# EAGLE design presentation (EAGLE 9.6.2)
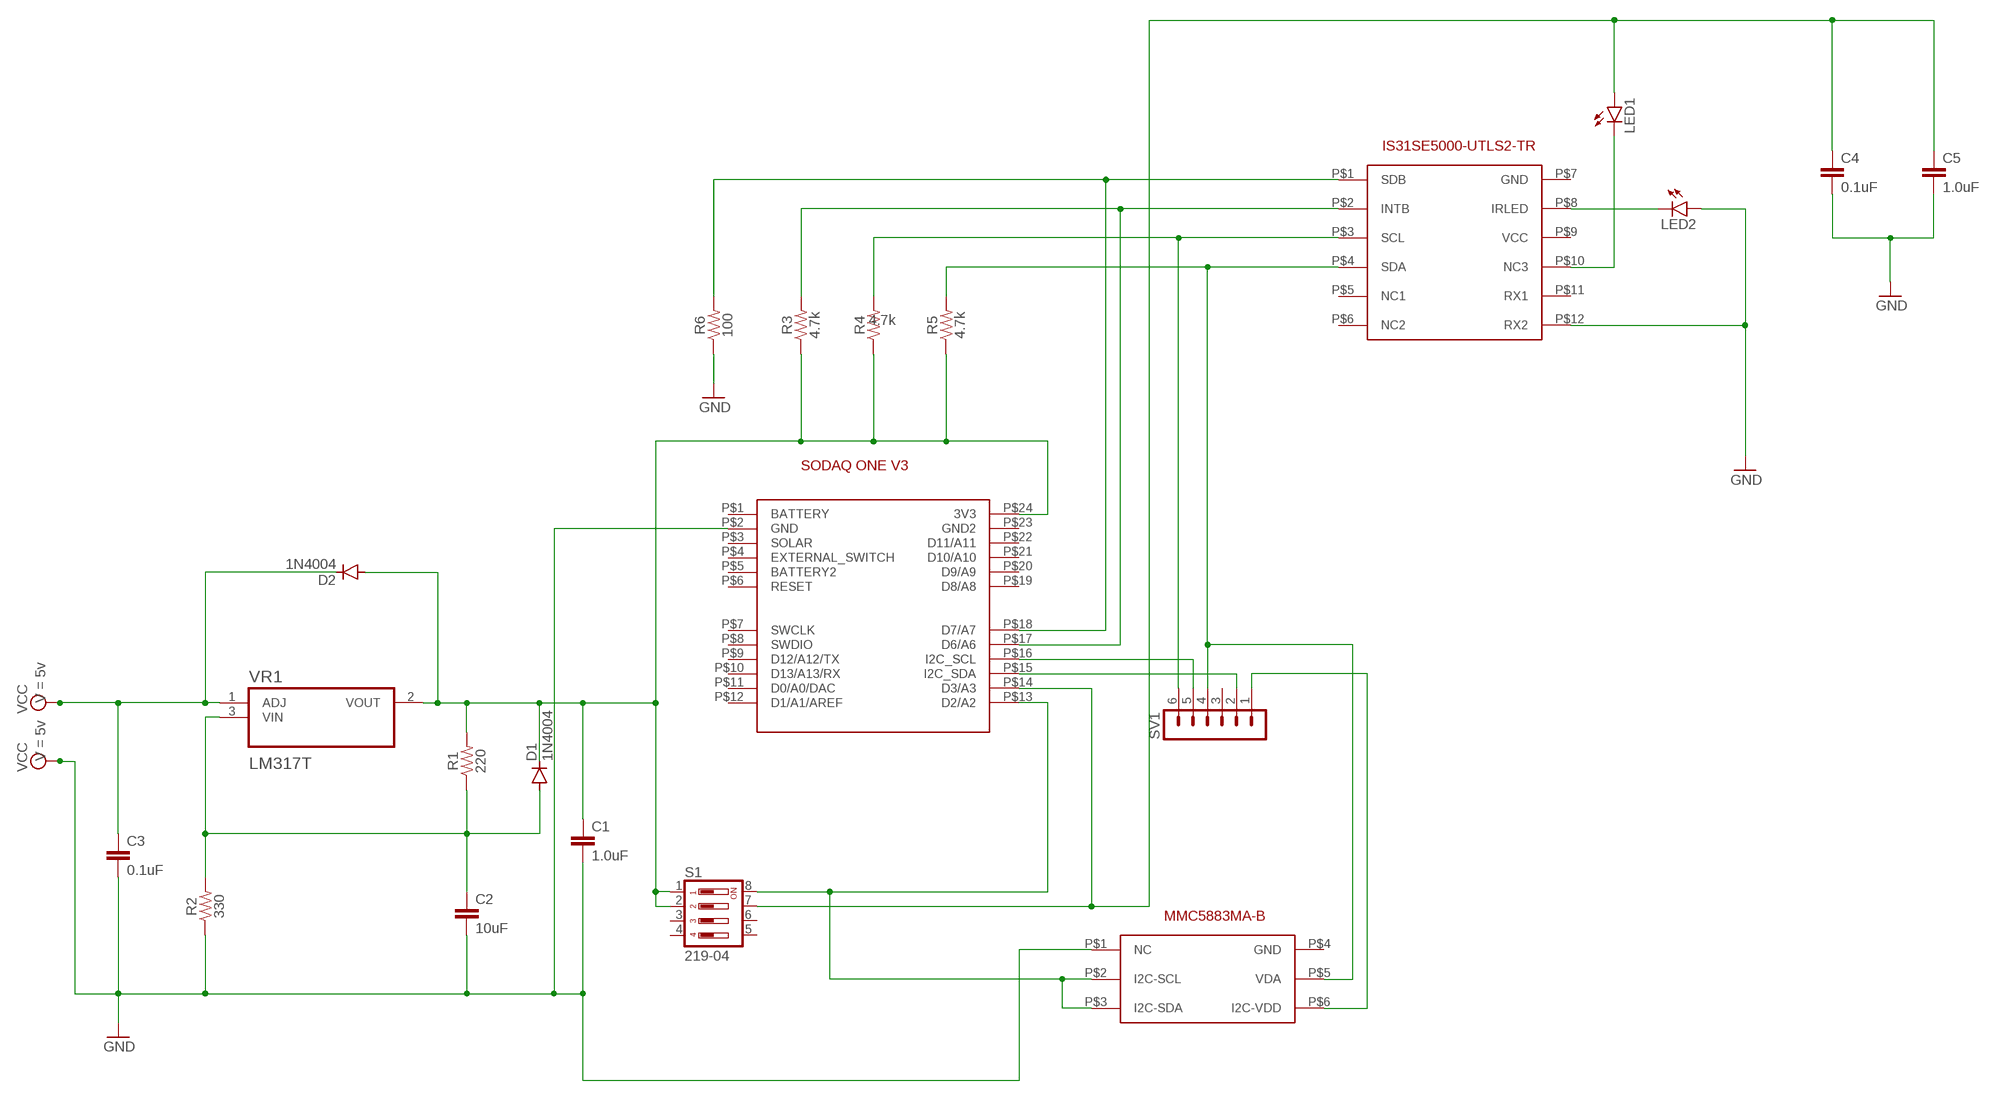
[diagram p0: schematic, sheet 1]

## Parts
C1  1.0uF  1.0UF-0402-16V-10%  [0402]
C2  10uF  10UF-0603-6.3V-20%  [0603]
C3  0.1uF  0.1UF-0402-6.3V-10%-X7R  [0402]
C4  0.1uF  0.1UF-0402-6.3V-10%-X7R  [0402]
C5  1.0uF  1.0UF-0402-16V-10%  [0402]
D1  1N4004  [DO41-10]
D2  1N4004  [DO41-10]
LED1  LED5MM  [LED5MM]
LED2  LED5MM  [LED5MM]
R1  220  220OHM-0603-1/10W-1%  [0603]
R2  330  330OHM-0603-1/10W-1%  [0603]
R3  4.7k  4.7KOHM-0603-1/10W-1%  [0603]
R4  4.7k  4.7KOHM-0603-1/10W-1%  [0603]
R5  4.7k  4.7KOHM-0603-1/10W-1%  [0603]
R6  100  100OHM-0603-1/10W-1%  [0603]
S1  219-04  [CTS-219-04]
SV1  MA06-1  [MA06-1]
U$1  SODAQONE  [SODAQONE]
U$2  MMC5883MA-B  [MMC5883MA-B]
U$3  IS31SE5000  [IS31SE5000]
VR1  LM317T  [TO254P1054X470X1955-3]

## Nets
GND: C4.2 C5.2 LED2.A R6.1 U$3.P$12(RX2)
N$1: C1.1 D1.C D2.A R1.2 R3.1 R4.1 R5.1 S1.1 S1.2 U$1.P$24(3V3) VR1.2(VOUT)
N$2: SV1.1 U$2.P$6(I2C-VDD)
N$3: R5.2 SV1.4 U$2.P$5(VDA) U$3.P$4(SDA)
N$4: S1.8 U$1.P$13(D2/A2) U$2.P$2(I2C-SCL) U$2.P$3(I2C-SDA)
N$5: C4.1 C5.1 LED1.A S1.7 U$1.P$14(D3/A3)
N$6: C2.1 D1.A R1.1 R2.2 VR1.3(VIN)
N$7: R6.2 U$1.P$18(D7/A7) U$3.P$1(SDB)
N$8: R3.2 U$1.P$17(D6/A6) U$3.P$2(INTB)
N$9: R4.2 SV1.6 U$3.P$3(SCL)
N$11: LED2.K(C) U$3.P$8(IRLED)
N$12: LED1.K(C) U$3.P$10(NC3)
N$13: SV1.2 U$1.P$15(I2C_SDA)
N$14: SV1.5 U$1.P$16(I2C_SCL)
VCC: C1.2 C2.2 C3.1 C3.2 D2.C R2.1 U$1.P$2(GND) U$2.P$1(NC) VR1.1(ADJ) ; supply symbol labelled GND
Unconnected: S1.3 S1.4 S1.5 S1.6 SV1.3 U$1.P$1(BATTERY) U$1.P$3(SOLAR) U$1.P$4(EXTERNAL_SWITCH) U$1.P$5(BATTERY2) U$1.P$6(RESET) U$1.P$7(SWCLK) U$1.P$8(SWDIO) U$1.P$9(D12/A12/TX) U$1.P$10(D13/A13/RX) U$1.P$11(D0/A0/DAC) U$1.P$12(D1/A1/AREF) U$1.P$19(D8/A8) U$1.P$20(D9/A9) U$1.P$21(D10/A10) U$1.P$22(D11/A11) U$1.P$23(GND2) U$2.P$4(GND) U$3.P$5(NC1) U$3.P$6(NC2) U$3.P$7(GND) U$3.P$9(VCC) U$3.P$11(RX1)

## Library data of the parts
C1 C5 = SparkFun-Capacitors:1.0UF: 1µF ceramic capacitors A capacitor is a passive two-terminal electrical component used to store electrical energy temporarily in an electric field.; PROD_ID: CAP-12417
C2 = SparkFun-Capacitors:10UF: 10.0µF ceramic capacitors A capacitor is a passive two-terminal electrical component used to store electrical energy temporarily in an electric field.; PROD_ID: CAP-11015
C3 C4 = SparkFun-Capacitors:0.1UF: 0.1µF ceramic capacitors A capacitor is a passive two-terminal electrical component used to store electrical energy temporarily in an electric field.; PROD_ID: CAP-14993
D1 D2 = diode:1N4004: DIODE general purpose rectifier, 1 A
LED1 LED2 = led:LED: LED OSRAM: - CHIPLED LG R971, LG N971, LY N971, LG Q971, LY Q971, LO R971, LY R971 LH N974, LH R974 LS Q976, LO Q976, LY Q976 LO Q996 - Hyper CHIPLED LW Q18S LB Q993, LB Q99A, LB R99A - SideLED LS A670, LO A670, LY A670, LG A670, LP A670 LB A673, LV A673, LT A673, LW A673 LH A674 LY A675 LS A676, LA A676, LO A676, LY A676, LW A676 LS A679, LY A679, LG A679 - Hyper Micro SIDELED® LS Y876, LA Y876, LO Y876, LY Y876 LT Y87S - SmartLED LW L88C, LW L88S LB L89C, LB L89S, LG L890 LS L89K, LO L89K, LY L89K LS L896, LA L896, LO L896, LY L896 - TOPLED LS T670, LO T670, LY T670, LG T670, LP T670 LSG T670, LSP T670, LSY T670, LOP T670, LYG T670 LG T671, LOG T671, LSG T671 LB T673, LV T673, LT T673, LW T673 LH T674 LS T676, LA T676, LO T676, LY T676, LB T676, LH T676, LSB T676, LW T676 LB T67C, LV T67C, LT T67C, LS T67K, LO T67K, LY T67K, LW E67C LS E67B, LA E67B, LO E67B, LY E67B, LB E67C, LV E67C, LT E67C LW T67C LS T679, LY T679, LG T679 LS T770, LO T770, LY T770, LG T770, LP T770 LB T773, LV T773, LT T773, LW T773 LH T774 LS E675, LA E675, LY E675, LS T675 LS T776, LA T776, LO T776, LY T776, LB T776 LHGB T686 LT T68C, LB T68C - Hyper Mini TOPLED® LB M676 - Mini TOPLED Santana® LG M470 LS M47K, LO M47K, LY M47K Source: http://www.osram.convergy.de LUXEON: - LUMILED® LXK2-PW12-R00, LXK2-PW12-S00, LXK2-PW14-U00, LXK2-PW14-V00 LXK2-PM12-R00, LXK2-PM12-S00, LXK2-PM14-U00 LXK2-PE12-Q00, LXK2-PE12-R00, LXK2-PE12-S00, LXK2-PE14-T00, LXK2-PE14-U00 LXK2-PB12-K00, LXK2-PB12-L00, LXK2-PB12-M00, LXK2-PB14-N00, LXK2-PB14-P00, LXK2-PB14-Q00 LXK2-PR12-L00, LXK2-PR12-M00, LXK2-PR14-Q00, LXK2-PR14-R00 LXK2-PD12-Q00, LXK2-PD12-R00, LXK2-PD12-S00 LXK2-PH12-R00, LXK2-PH12-S00 LXK2-PL12-P00, LXK2-PL12-Q00, LXK2-PL12-R00 Source: www.luxeon.com KINGBRIGHT: KA-3528ASYC Source: www.kingbright.com
R1 = SparkFun-Resistors:220OHM: 220Ω resistor A resistor is a passive two-terminal electrical component that implements electrical resistance as a circuit element. Resistors act to reduce current flow, and, at the same time, act to lower voltage levels within circuits. - Wikipedia; PROD_ID: RES-07861
R2 = SparkFun-Resistors:330OHM: 330Ω resistor A resistor is a passive two-terminal electrical component that implements electrical resistance as a circuit element. Resistors act to reduce current flow, and, at the same time, act to lower voltage levels within circuits. - Wikipedia; PROD_ID: RES-00818
R3-R5 = SparkFun-Resistors:4.7KOHM: 4.7kΩ resistor A resistor is a passive two-terminal electrical component that implements electrical resistance as a circuit element. Resistors act to reduce current flow, and, at the same time, act to lower voltage levels within circuits. - Wikipedia; PROD_ID: RES-07857
R6 = SparkFun-Resistors:100OHM: 100Ω resistor A resistor is a passive two-terminal electrical component that implements electrical resistance as a circuit element. Resistors act to reduce current flow, and, at the same time, act to lower voltage levels within circuits. - Wikipedia; PROD_ID: RES-07863
S1 = switch-dil:219-04*: Surface Mount DIP Switch Series 219 SMT CTS Electronic Components Sourc: www.ctscorp.com; OC_FARNELL: unknown; OC_NEWARK: unknown
SV1 = con-lstb:MA06-1: PIN HEADER; OC_FARNELL: unknown; OC_NEWARK: unknown
U$1 = SODAQONE:SODAQONE: Designed by Prem and Pranav
U$2 = MMC5883MA-B:MMC5883MA-B: Designed by Prem and Pranav
U$3 = IS31SE5000:IS31SE5000
VR1 = LM317T:LM317T: Check prices <https://pricing.snapeda.com/parts/LM317T/Texas%20Instruments/view-part?ref=eda>; AVAILABILITY: Good; DESCRIPTION: 1.5-A, 40-V, adjustable linear voltage regulator 3-TO-220; MF: Texas Instruments; MP: LM317T; PACKAGE: TO-220-3 Texas Instruments; PRICE: None; PURCHASE-URL: https://pricing.snapeda.com/search/part/LM317T/?ref=eda

## Board
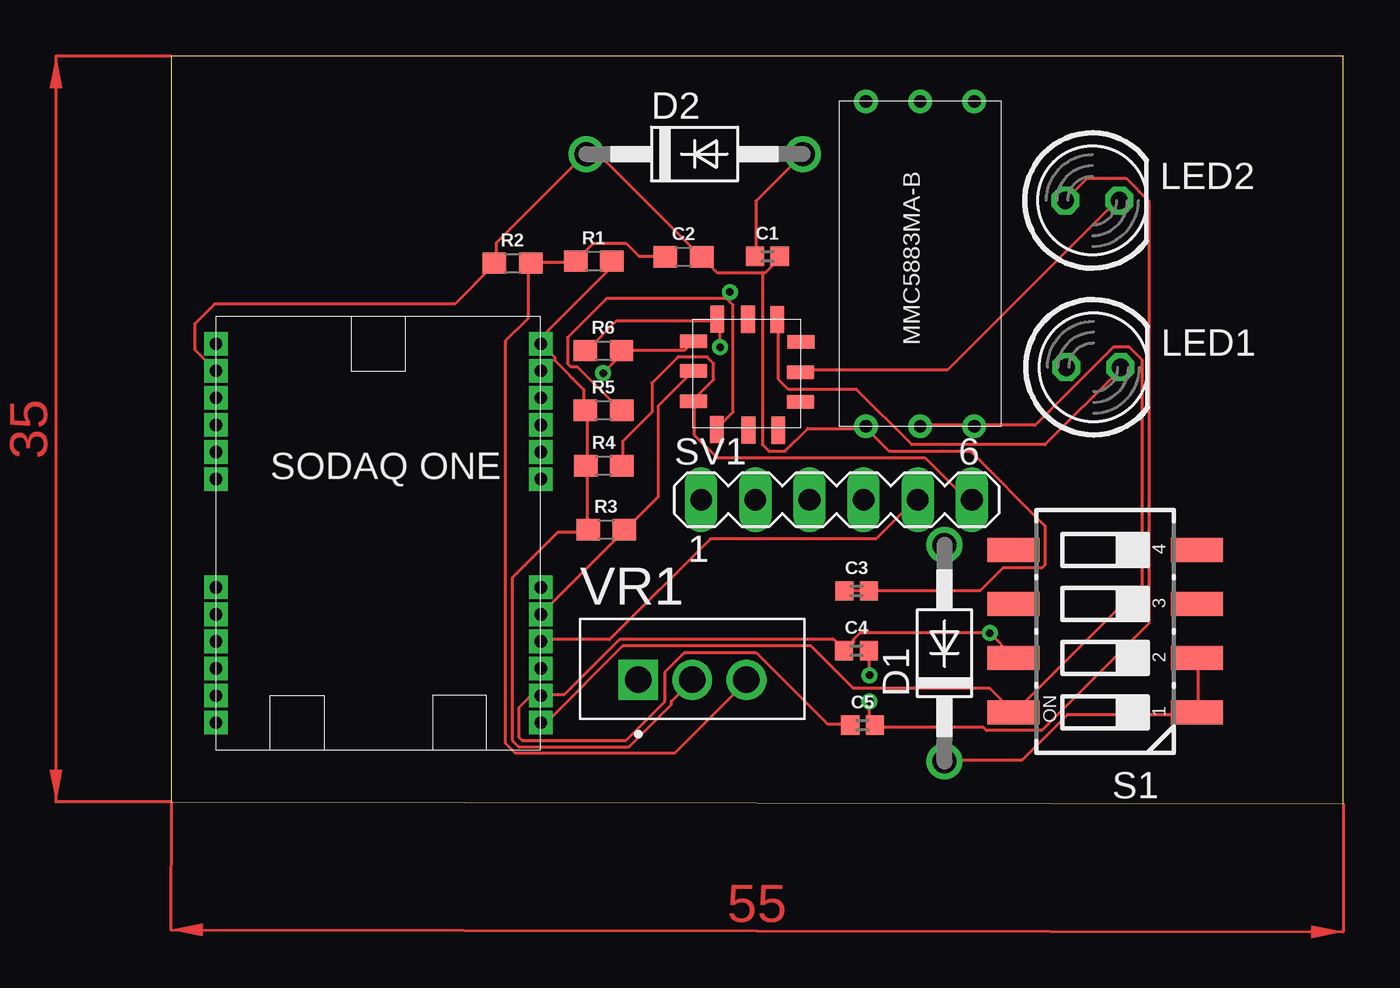
[diagram p1: board, top side]
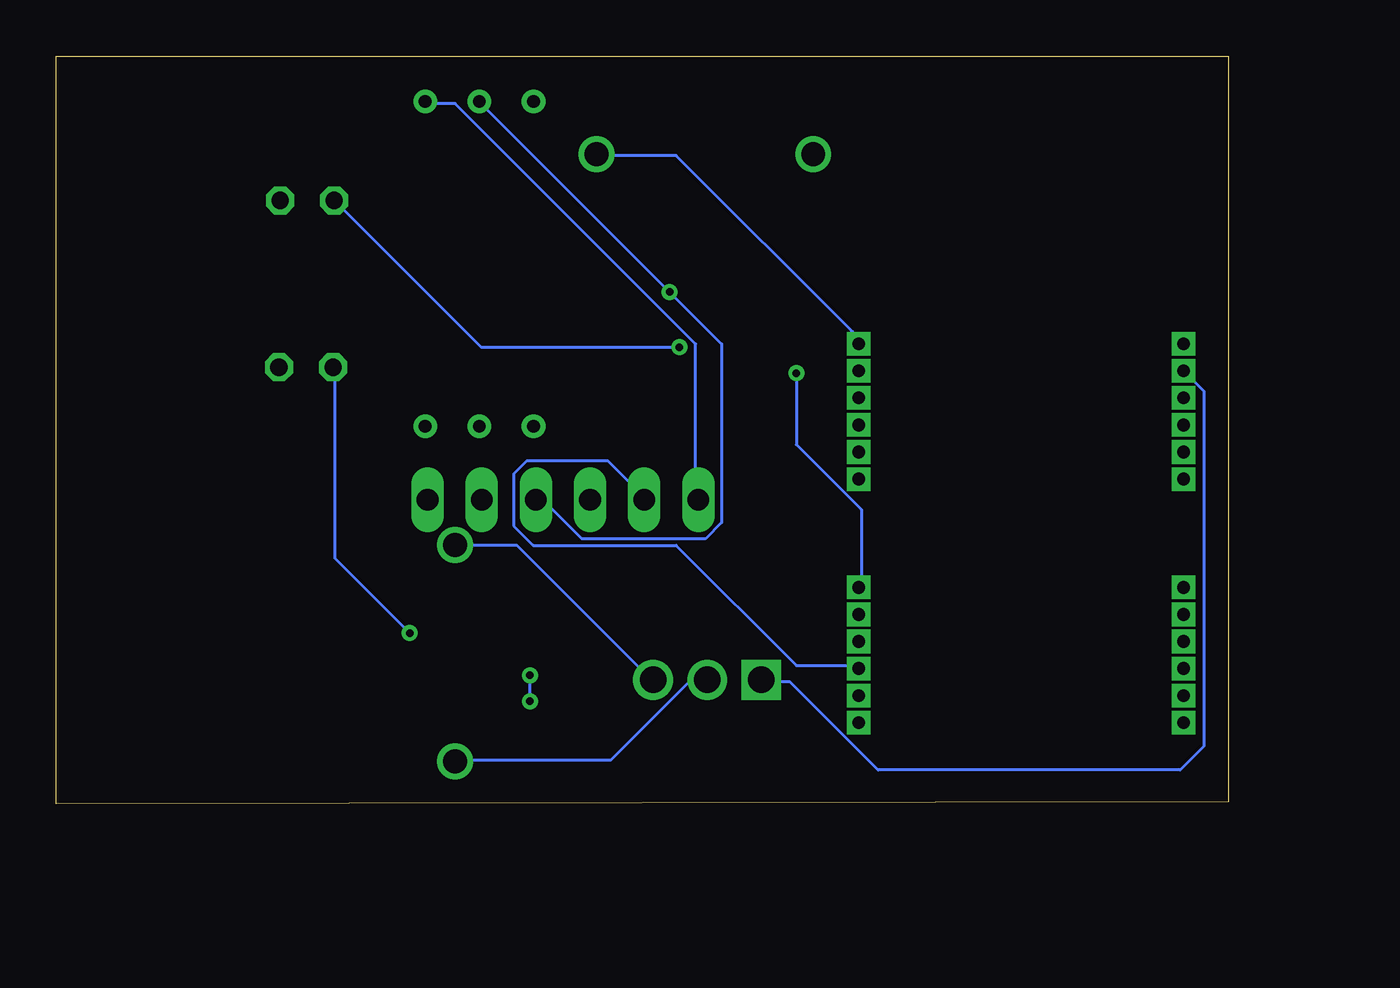
[diagram p2: board, bottom side, seen from below]

Size 55 x 35.1 mm. Coordinates in mm from the lower left corner, seen from the top.
Outline: 0,0.1 55,0 55,35.1 0,35.1 0,0.1
Copper layers (1*16): Top 0.035mm / dielectric 1.5mm / Bottom 0.035mm
Design rules "default": minimum track width 6mil, minimum drill 0.35mm, track to track 6mil, track to pad 6mil, pad to pad 6mil, via to via 6mil, smd to smd 6mil, copper to edge 40mil, drill to drill 6mil, minimum pad ring 10mil, minimum via ring 8mil, stop-mask expansion 4mil, vias tented up to drill 0mil, thermal gap 10mil

### Footprints (pad centres in the part's own frame; a part is rotated, then mirrored left to right if it is on the bottom)
0402 = smd 0.85 x 0.9: 1 -0.58,0; 2 0.58,0
0603 = smd 1.1 x 1: 1 -0.85,0; 2 0.85,0
DO41-10 = drill 1.118: A 5.08,0; C -5.08,0
LED5MM = drill 0.813 octagon: A -1.27,0; K 1.27,0
CTS-219-04 = smd 1.13 x 2.44: 1 -3.81,-4.3; 2 -1.27,-4.3; 3 1.27,-4.3; 4 3.81,-4.3; 5 3.81,4.3; 6 1.27,4.3; 7 -1.27,4.3; 8 -3.81,4.3
MA06-1 = drill 1.016 long: 1 -6.35,0; 2 -3.81,0; 3 -1.27,0; 4 1.27,0; 5 3.81,0; 6 6.35,0
SODAQONE = drill 0.6 square: P$1 -7.62,8.89; P$2 -7.62,7.62; P$3 -7.62,6.35; P$4 -7.62,5.08; P$5 -7.62,3.81; P$6 -7.62,2.54; P$7 -7.62,-2.54; P$8 -7.62,-3.81; P$9 -7.62,-5.08; P$10 -7.62,-6.35; P$11 -7.62,-7.62; P$12 -7.62,-8.89; P$13 7.62,-8.89; P$14 7.62,-7.62; P$15 7.62,-6.35; P$16 7.62,-5.08; P$17 7.62,-3.81; P$18 7.62,-2.54; P$19 7.62,2.54; P$20 7.62,3.81; P$21 7.62,5.08; P$22 7.62,6.35; P$23 7.62,7.62; P$24 7.62,8.89
MMC5883MA-B = drill 0.6: P$1 -7.62,2.54; P$2 -7.62,0; P$3 -7.62,-2.54; P$4 7.62,2.54; P$5 7.62,0; P$6 7.62,-2.54
IS31SE5000 = smd 1.27 x 0.635: P$1 -2.487,1.519; P$2 -2.487,0.127; P$3 -2.487,-1.308; P$7 2.532,-1.333; P$8 2.53,0.058; P$9 2.55,1.494 | smd 0.635 x 1.27: P$4 -1.407,-2.626; P$5 0.086,-2.644; P$6 1.478,-2.659; P$10 1.427,2.543; P$11 0.064,2.545; P$12 -1.374,2.55
TO254P1054X470X1955-3 = drill 1.24 square: 1 -2.54,0 | drill 1.24: 2 0,0; 3 2.54,0

### Placement (x,y rotation side)
C1  27.97,25.7 0 top
C2  24.04,25.68 0 top
C3  32.16,10 0 top
C4  32.15,7.2 0 top
C5  32.44,3.7 0 top
D1  36.28,7.08 90 top
D2  24.56,30.5 0 top
LED1  43.27,20.5 0 top
LED2  43.22,28.32 0 top
R1  19.83,25.48 0 top
R2  16.02,25.38 0 top
R3  20.41,12.88 0 top
R4  20.3,15.88 0 top
R5  20.29,18.48 0 top
R6  20.28,21.28 0 top
S1  43.82,8.12 90 top
SV1  31.22,14.28 0 top
U$1  9.72,12.71 0 top
U$2  35.14,25.35 90 top
U$3  27,20.2 0 top
VR1  24.45,5.83 0 top

### Tracks (layer width: path | path; a pad name or v marks a point on that pad's centre or on a via)
GND  (via drill 0.35)
  Top 0.152: R6.1 19.51,21.28 20.88,22.66 25.6,22.66 U$3.P$12 25.76,22.66 v25.76,21.44 | LED2.A 42.06,28.45 42.98,29.36 44.81,29.36 45.87,28.29 45.87,8.48 40.84,3.45 38.25,3.45 38.1,3.6 33.07,3.6 C5.2 32.92,3.76 32.77,3.91 v32.77,4.82 | v32.77,6.04 32.77,7.11 C4.2
  Bottom 0.152: v32.77,4.82 v32.77,6.04 | v25.76,21.44 35.05,21.44 41.91,28.29 LED2.A
N$1
  Top 0.152: S1.2 48.16,6.81 48.16,4.37 S1.1 48.01,4.21 42.06,4.21 39.93,2.08 36.42,2.08 D1.C | C1.1 27.43,25.7 27.43,28.29 29.57,30.43 D2.A | 17.69,22.21 17.22,21.74 17.98,20.98 17.98,20.83 19.36,19.46 19.36,18.54 R5.1 19.51,18.39 19.51,15.95 R4.1 19.51,15.8 19.51,12.9 R3.1 19.51,12.75 18.14,12.75 16,10.62 16,3 16.31,2.69 21.49,2.69 23.47,4.67 23.47,4.82 24.38,5.74 VR1.2 | 17.69,22.21 20.57,25.09 20.57,25.4 R1.2 | 17.69,22.21 U$1.P$24
  Bottom 0.152: VR1.2 24.54,5.74 25.3,5.74 28.96,2.08 36.27,2.08 D1.C | D2.A 29.57,30.43 25.91,30.43 17.69,22.21 U$1.P$24
N$2
  Bottom 0.152: U$2.P$6 37.64,32.87 36.27,32.87 24.99,21.59 24.99,14.43 SV1.1
N$3  (via drill 0.35)
  Top 0.152: 25.91,23.72 26.06,23.72 26.36,23.42 26.36,18.39 25.6,17.63 U$3.P$4 | 25.91,23.72 20.42,23.72 18.59,21.89 18.59,20.67 18.75,20.52 19.05,20.52 21.03,18.54 R5.2 | 25.91,23.72 v26.21,24.03
  Bottom 0.152: U$2.P$5 35.05,32.87 v26.21,24.03 23.77,21.59 23.77,13.21 24.54,12.44 30.33,12.44 32.16,14.27 32.46,14.27 SV1.4
N$4
  Top 0.152: U$2.P$2 35.2,17.78 37.64,17.78 U$2.P$3 37.8,17.78 40.54,17.78 44.2,21.44 44.96,21.44 45.57,20.83 45.57,10.31 39.62,4.37 S1.8 39.47,4.37 38.41,5.43 32,5.43 30.02,7.42 21.18,7.42 17.68,3.91 17.42,3.91 U$1.P$13
N$5  (via drill 0.35)
  Top 0.152: C5.1 31.85,3.76 30.79,3.76 27.43,7.11 24.08,7.11 23.16,6.2 23.16,4.82 21.34,3 16.46,3 16.31,3.15 16.31,4.52 16.76,4.98 17.27,4.98 U$1.P$14 17.42,5.13 18.44,5.13 21.03,7.72 31.09,7.72 31.55,7.26 C4.1 31.7,7.26 32,7.57 32,7.72 32.31,8.03 v38.41,8.03 39.47,6.96 S1.7
  Bottom 0.152: v38.41,8.03 41.91,11.53 41.91,20.37 LED1.A
N$6
  Top 0.152: C2.1 23.16,25.7 21.95,25.7 21.34,26.31 19.81,26.31 19.05,25.55 R1.1 18.9,25.4 16.92,25.4 R2.2 16.76,25.25 16.76,22.81 15.7,21.74 15.7,2.84 16.15,2.39 23.62,2.39 26.98,5.74 VR1.3
  Bottom 0.152: D1.A 36.27,12.14 33.38,12.14 27.13,5.89 VR1.3
N$7  (via drill 0.35)
  Top 0.152: U$3.P$1 24.38,21.59 24.08,21.28 21.18,21.28 R6.2 21.18,21.13 v20.27,20.22
  Bottom 0.152: v20.27,20.22 20.27,16.86 17.22,13.82 17.22,10.38 U$1.P$18
N$8
  Top 0.152: U$1.P$17 21.18,12.75 R3.2 21.34,12.9 22.86,14.43 22.86,18.69 24.38,20.22 U$3.P$2
N$9
  Top 0.152: R4.2 21.18,15.95 21.18,17.02 22.55,18.39 22.55,19.76 23.77,20.98 25.15,20.98 25.45,20.67 25.45,19.91 24.54,19 U$3.P$3 24.54,18.85 24.54,17.32 25.6,16.25 35.36,16.25 37.19,14.43 37.49,14.43 SV1.6
N$11
  Top 0.152: U$3.P$8 29.57,20.37 36.42,20.37 44.35,28.29 LED2.K
N$12
  Top 0.152: U$3.P$10 28.5,22.66 28.5,19.91 28.96,19.46 32.16,19.46 34.75,16.86 41,16.86 44.5,20.37 LED1.K
N$13
  Bottom 0.152: U$1.P$15 17.42,6.5 20.27,6.5 25.91,12.14 32.61,12.14 33.53,13.05 33.53,15.49 32.92,16.1 29.11,16.1 27.43,14.43 SV1.2
N$14
  Top 0.152: U$1.P$16 17.42,7.72 20.57,7.72 25.3,12.44 33.07,12.44 34.9,14.27 SV1.5
VCC
  Top 0.152: C3.1 31.7,10.01 32.61,10.01 C3.2 32.77,10.01 37.95,10.01 39.01,11.07 40.84,11.07 41,11.22 41,13.05 37.49,16.56 33.68,16.56 32.61,17.63 U$2.P$1 32.46,17.63 29.87,17.63 28.8,16.56 28.04,16.56 27.74,16.86 27.74,24.94 | 27.74,24.94 25.6,24.94 24.99,25.55 C2.2 24.84,25.7 20.12,30.43 19.51,30.43 D2.C 19.36,30.43 15.24,26.31 15.24,25.4 R2.1 15.09,25.25 13.31,23.47 2.04,23.47 1.1,22.53 1.1,21.33 U$1.P$2 | 27.74,24.94 27.89,24.94 28.5,25.55 C1.2
  Bottom 0.152: U$1.P$2 1.14,19.37 1.14,2.71 2.26,1.6 16.43,1.6 20.57,5.74 21.79,5.74 VR1.1
(copper drawn outside any net)
  shapes: Top area x2